# Altium schematic sheet Memory & Sensor.SchDoc
size A4; SheetNumber: 2; SheetTotal: 4
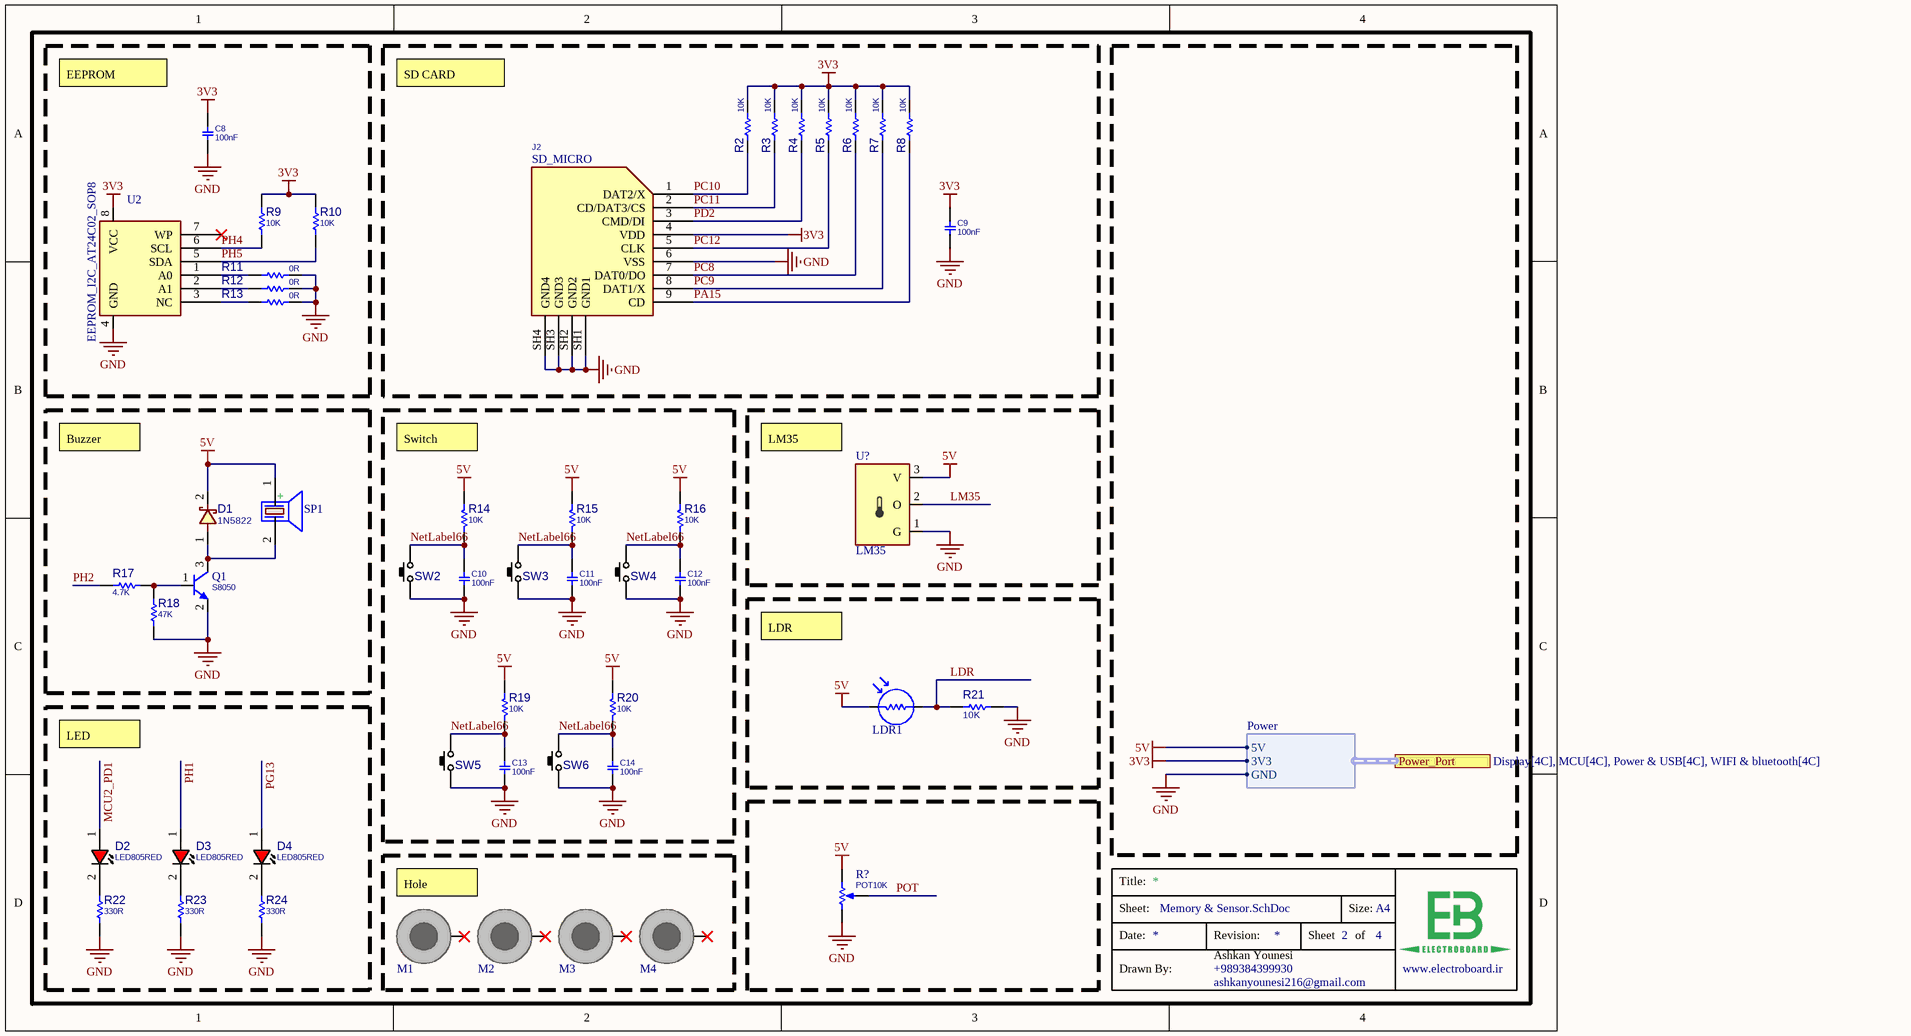
[diagram p0: Memory & Sensor.SchDoc]

## Parts
C8  100nF  [C0603]
C9  100nF  [C0603]
C10  100nF  [C0603]
C11  100nF  [C0603]
C12  100nF  [C0603]
C13  100nF  [C0603]
C14  100nF  [C0603]
D1  1N5822  [D_SMA]
D2  LED805RED  [LED0805RED]
D3  LED805RED  [LED0805RED]
D4  LED805RED  [LED0805RED]
J2  SD_MICRO  [SDMICRO_AT]
LDR1  PhotoCell  [PhotoCell]  (value not drawn)
M1  DNP/MH  [SCMH_M3F]  (value not drawn)  (no BOM)
M2  DNP/MH  [SCMH_M3F]  (value not drawn)  (no BOM)
M3  DNP/MH  [SCMH_M3F]  (value not drawn)  (no BOM)
M4  DNP/MH  [SCMH_M3F]  (value not drawn)  (no BOM)
Q1  S8050  [SOT23_3]
R2  10K  [R0603]
R3  10K  [R0603]
R4  10K  [R0603]
R5  10K  [R0603]
R6  10K  [R0603]
R7  10K  [R0603]
R8  10K  [R0603]
R9  10K  [R0603]
R10  10K  [R0603]
R11  0R  [R0603]
R12  0R  [R0603]
R13  0R  [R0603]
R14  10K  [R0603]
R15  10K  [R0603]
R16  10K  [R0603]
R17  4.7K  [R0603]
R18  47K  [R0603]
R19  10K  [R0603]
R20  10K  [R0603]
R21  10K  [R0805]
R22  330R  [R0603]
R23  330R  [R0603]
R24  330R  [R0603]
R?  POT10K  [POT_3296W]
SP1  (no value)  [BUZZER 7.62mm DC]
SW2  PUSHBUTTON  [SWPBS_SPST_6X3X5]  (value not drawn)
SW3  PUSHBUTTON  [SWPBS_SPST_6X3X5]  (value not drawn)
SW4  PUSHBUTTON  [SWPBS_SPST_6X3X5]  (value not drawn)
SW5  PUSHBUTTON  [SWPBS_SPST_6X3X5]  (value not drawn)
SW6  PUSHBUTTON  [SWPBS_SPST_6X3X5]  (value not drawn)
U2  EEPROM_I2C_AT24C02_SOP8  [SO_8]
U?  LM35  [TO92_3]

## Ports
Power_Port (harness POWER, see Display[4C], MCU[4C], Power & USB[4C], WIFI & bluetooth[4C])

## Harnesses
Power: 5V, 3V3, GND

## Nets
3V3: C8.2 C9.1 J2.4(VDD) R2.2 R3.2 R4.2 R5.2 R6.2 R7.2 R8.2 R9.2 R10.2 U2.8(VCC) ; port Power_Port.3V3
5V: D1.2 LDR1.1 R14.2 R15.2 R16.2 R19.2 R20.2 R?.3(BOT) SP1.1(+) U?.3(V) ; port Power_Port.5V
GND: C8.1 C9.2 C10.1 C11.1 C12.1 C13.1 C14.1 J2.6(VSS) J2.SH1(GND1) J2.SH2(GND2) J2.SH3(GND3) J2.SH4(GND4) Q1.2(E) R11.2 R12.2 R13.2 R18.1 R21.1 R22.1 R23.1 R24.1 R?.1(TOP) SW2.2(P3) SW3.2(P3) SW4.2(P3) SW5.2(P3) SW6.2(P3) U2.4(GND) U?.1(G) ; port Power_Port.GND
LDR: LDR1.2 R21.2
LM35: U?.2(O)
MCU2_PD1: D2.1(ANODE)
NetLabel66: C10.2 C11.2 C12.2 C13.2 C14.2 R14.1 R15.1 R16.1 R19.1 R20.1 SW2.1(P1) SW3.1(P1) SW4.1(P1) SW5.1(P1) SW6.1(P1)
PA15: J2.9(CD) R8.1
PC8: J2.7(DAT0/DO) R6.1
PC9: J2.8(DAT1/X) R7.1
PC10: J2.1(DAT2/X) R2.1
PC11: J2.2(CD/DAT3/CS) R3.1
PC12: J2.5(CLK) R5.1
PD2: J2.3(CMD/DI) R4.1
PG13: D4.1(ANODE)
PH1: D3.1(ANODE)
PH2: R17.2
PH4: R9.1 U2.6(SCL)
PH5: R10.1 U2.5(SDA)
POT: R?.2(TAP)
NetD1_1: D1.1 Q1.3(C) SP1.2(-)
NetD2_2: D2.2(CATHODE) R22.2
NetD3_2: D3.2(CATHODE) R23.2
NetD4_2: D4.2(CATHODE) R24.2
NetQ1_1: Q1.1(B) R17.1 R18.2
NetR11_1: R11.1 U2.1(A0)
NetR12_1: R12.1 U2.2(A1)
NetR13_1: R13.1 U2.3(NC)

Not connected (* = marked no-connect by the designer): M1 1*; M2 1*; M3 1*; M4 1*; U2 7(WP)*

## Notes on the sheet
- EEPROM
- SD CARD
- Buzzer
- Switch
- LM35
- LDR
- LED
- (near M1) Hole
- Title:
- Sheet:
- Size:
- A4
- Drawn By:
- Date:
- Revision:
- Ashkan Younesi
- ashkanyounesi216@gmail.com
- +989384399930
- Sheet
- of
- www.electroboard.ir <http://www.electroboard.ir>

## Library data of the parts
C8-C14 = CAP_SMD_MLCC: CAP, MLCC, 1nF, 50V, C0G, 10%, 0402; DESC: CAP, MLCC, 100nF, 50V, C0G, 10%, 0402; MANF_P#: MANF_PART#; MANF: Murata; PARAM: C0G, 10%; PRICE: 100= 1$; PARAM2: 50V; ASSEMBLY: ASSEMBLY; VALUE: 100nF
D1 = DIODE_SMD_SCHOTTKY_1N5822: DIODE, SCHOTTKY, 40V, 3A; MANF: DIODES; DESC: DESCRIPTION; MANF_P#: 1N5822; ASSEMBLY: ASSEMBLY; PRICE: PRICE; PARAM2: 3A; PARAM: 40V; VALUE: 1N5822
D2-D4 = LED_SMD_0805_RED: LED, SMD, 0805, RED; DESC: DESCRIPTION; MANF_P#: MANF_PART#; PARAM2: 2.2V; MANF: MANF; ASSEMBLY: ASSEMBLY; PRICE: 36t@Javan; VALUE: LED805RED
J2 = SOCKET_SDMICRO_AT: SD MICRO exist in Iran, Attend 112J-TDAR-R01; PARAM: push-push; MANF: Attend; MANF_P#: 112J-TDAR-R01; VALUE: SD_MICRO
LDR1 = LDR: Photo Cell- Variable Resistor With Light; Company: IPA CO.; Designer: Saeid Jorablo; Last Update Time: 2008/07/17
M1-M4 = SCMH_M3F: SCREW mouting, M3, 3.0mm diameter and 6.0mm FlangeHead; ASSEMBLY: DNP; VALUE: DNP/MH
Q1 = NPN_S8050_SOT23: BJT, NPN, 25v, 0.5A, SMD, SOT23; PARAM2: 300mW; PARAM: 25v, 0.5A; MANF_P#: S8050; MANF: -; VALUE: S8050
R2-R20 R22-R24 = RES_SMD: RESISTOR, SMD; PARAM: -W; DESC: DESCRIPTION; DIST#: MOUSER; PARAM2: 1%; MANF_P#: -; MANF: -; ASSEMBLY: ASSEMBLY; PRICE: 100= 0.5$
  R2-R10 R14-R16 R19 R20: VALUE: 10K
  R11-R13: VALUE: 0R
  R17: VALUE: 4.7K
  R18: VALUE: 47K
  R22-R24: VALUE: 330R
R21 = RES_SMD_0805: RESISTOR, SMD; PARAM: -W; DESC: DESCRIPTION; DIST#: MOUSER; PARAM2: 1%; MANF_P#: -; MANF: -; ASSEMBLY: ASSEMBLY; PRICE: 100= 0.5$; VALUE: 10K
R? = RES_THD_POT_MULTITURN: RESISTOR, THD, Potentiometer Multiturn, most Popular; VALUE: POT10K
SP1 = PIEZO BUZZER: PIEZO BUZZER ACTIVE; Designer: Abbas Basereh; Comment_1: SPEAKER AND BEEP; Design Date: 1395/11/14; ComponentLink2Description: Reference; PackageDescription: THD; Publisher: Abbas Basereh; Mounting Technology: THD; Pin Count: 2; Status: Unreleased
SW2-SW6 = SWPBS_SPST_6X3X5: SWITCH, PUSH BUTTON, TACTILE, SMD, SPST, 6X3.5X5mm; MANF: ALPS; DESC: DESCRIPTION; MANF_P#: SKQMBBE010; VALUE: PUSHBUTTON; ASSEMBLY: ASSEMBLY; PARAM: PARAM; PRICE: PRICE
U2 = EEPROM_I2C_AT24C02_SOP8: EEPROM, I2C; VALUE: AT24C02
U? = TMP_LM35_TO92: SENSOR, TEMP, ANALOG, -55~150oC, 4~20Vcc, Out 0mV + 10mV/oC; MANF_P#: LM35CZ, LM35CAZ or LM35DZ; MANF: TI; PARAM: 0.5°C Accuracy, 10mV/oC, -55~150oC; PARAM2: 4~20Vcc; PRICE: 7$; VALUE: LM35